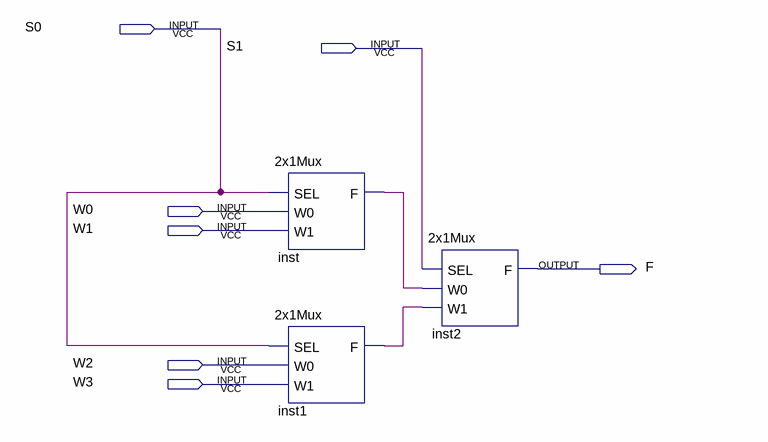
[diagram p0: schematic sheet]
// Quartus schematic 4x1Mux.bdf as structural Verilog: 3 symbols, 7 pins
module \4x1Mux  (
  input  S0,
  input  S1,
  input  W0,
  input  W1,
  input  W2,
  input  W3,
  output F
);

  wire inst1_f, inst_f;

  \2x1Mux  inst (.SEL(S0), .W0(W0), .W1(W1), .F(inst_f));
  \2x1Mux  inst1 (.SEL(S0), .W0(W2), .W1(W3), .F(inst1_f));
  \2x1Mux  inst2 (.SEL(S1), .W0(inst_f), .W1(inst1_f), .F(F));
endmodule
